# Altium project Logic Controller REV1.PrjPcb
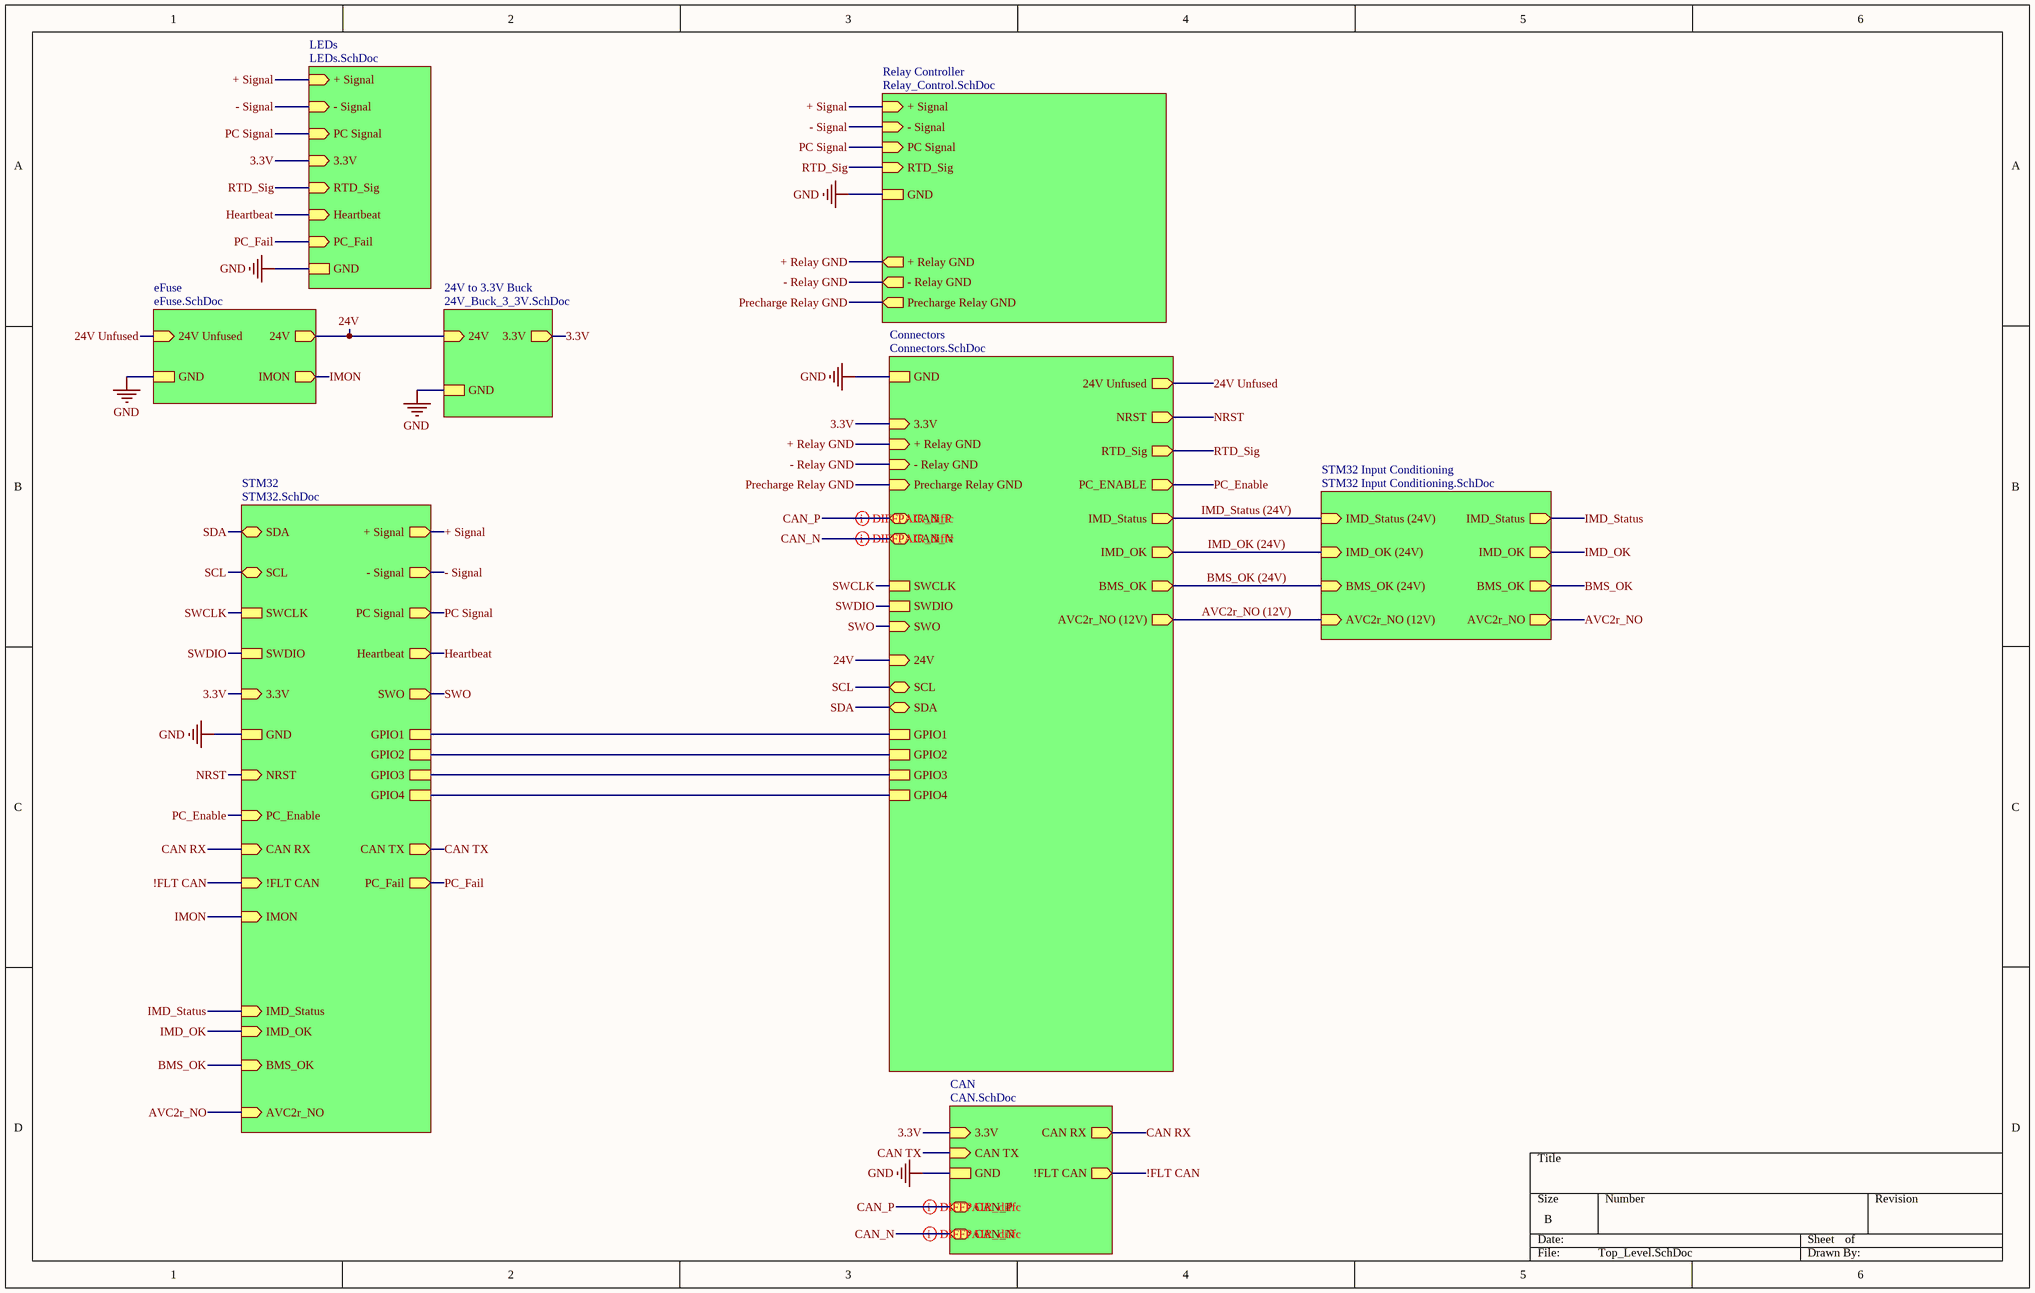
[diagram p0: Top_Level.SchDoc]
10 sheets, 106 parts. Net scope: hierarchical (ports join the sheet entries above them; power ports are global).
Board file: Logic_Controller_REV1.PcbDoc
Sheets:
  Top_Level.SchDoc
    Relay Controller = Relay_Control.SchDoc
    Connectors = Connectors.SchDoc
    LEDs = LEDs.SchDoc
      + = LED_Driver.SchDoc
      - = LED_Driver.SchDoc
      PC = LED_Driver.SchDoc
      HB = LED_Driver.SchDoc
      RTD_Sig_In = LED_Driver.SchDoc
      PC_Fail = Precharge_Fail.SchDoc
    STM32 = STM32.SchDoc
    eFuse = eFuse.SchDoc
    24V to 3.3V Buck = 24V_Buck_3_3V.SchDoc
    CAN = CAN.SchDoc

## Sheet Top_Level.SchDoc
size B; SheetNumber: 2; SheetTotal: 13

### Sub-sheets
24V to 3.3V Buck = 24V_Buck_3_3V.SchDoc: 24V (in), GND, 3.3V (out)
CAN = CAN.SchDoc: 3.3V (in), GND, CAN RX (out), CAN TX (in), !FLT CAN (out), CAN_P (bidir), CAN_N (bidir)
Connectors = Connectors.SchDoc: GND, + Relay GND (in), - Relay GND (in), Precharge Relay GND (in), 24V Unfused (out), 3.3V (in), NRST (out), GPIO1, GPIO2, GPIO3, GPIO4, PC_ENABLE (out), CAN_P (bidir), CAN_N (bidir), RTD_Sig (out), 24V (in), SWCLK, SWDIO, SWO (in), SCL (bidir), SDA (bidir), IMD_Status (out), IMD_OK (out), BMS_OK (out), AVC2r_NO (12V) (out)
eFuse = eFuse.SchDoc: 24V Unfused (in), GND, 24V (out), IMON (out)
LEDs = LEDs.SchDoc: + Signal (in), - Signal (in), PC Signal (in), 3.3V (in), GND, RTD_Sig (in), Heartbeat (in), PC_Fail (in)
Relay Controller = Relay_Control.SchDoc: + Signal (in), - Signal (in), PC Signal (in), RTD_Sig (in), GND, + Relay GND (out), - Relay GND (out), Precharge Relay GND (out)
STM32 = STM32.SchDoc: SDA (bidir), SCL (bidir), 3.3V (in), + Signal (out), - Signal (out), PC Signal (out), GND, SWCLK, SWDIO, SWO (out), NRST (in), GPIO1, GPIO2, GPIO3, GPIO4, PC_Enable (in), CAN TX (out), CAN RX (in), Heartbeat (out), !FLT CAN (in), IMON (in), PC_Fail (out), IMD_Status (in), IMD_OK (in), BMS_OK (in), AVC2r_NO (in)
STM32 Input Conditioning = STM32 Input Conditioning.SchDoc (file not in this document): IMD_Status (24V) (in), BMS_OK (24V) (in), IMD_Status (out), IMD_OK (24V) (in), IMD_OK (out), AVC2r_NO (12V) (in), BMS_OK (out), AVC2r_NO (out)

### Nets
GND: sheet Relay Controller/GND, sheet Connectors/GND, sheet LEDs/GND, sheet STM32/GND, sheet eFuse/GND, sheet 24V to 3.3V Buck/GND, sheet CAN/GND
3.3V: sheet Connectors/3.3V, sheet LEDs/3.3V, sheet STM32/3.3V, sheet 24V to 3.3V Buck/3.3V, sheet CAN/3.3V
24V: sheet Connectors/24V, sheet eFuse/24V, sheet 24V to 3.3V Buck/24V
24V Unfused: sheet Connectors/24V Unfused, sheet eFuse/24V Unfused
!FLT CAN: sheet STM32/!FLT CAN, sheet CAN/!FLT CAN
+ Relay GND: sheet Relay Controller/+ Relay GND, sheet Connectors/+ Relay GND
+ Signal: sheet Relay Controller/+ Signal, sheet LEDs/+ Signal, sheet STM32/+ Signal
- Relay GND: sheet Relay Controller/- Relay GND, sheet Connectors/- Relay GND
- Signal: sheet Relay Controller/- Signal, sheet LEDs/- Signal, sheet STM32/- Signal
AVC2r_NO: sheet STM32/AVC2r_NO, sheet STM32 Input Conditioning/AVC2r_NO
AVC2r_NO (12V): sheet Connectors/AVC2r_NO (12V), sheet STM32 Input Conditioning/AVC2r_NO (12V)
BMS_OK: sheet STM32/BMS_OK, sheet STM32 Input Conditioning/BMS_OK
BMS_OK (24V): sheet Connectors/BMS_OK, sheet STM32 Input Conditioning/BMS_OK (24V)
CAN RX: sheet STM32/CAN RX, sheet CAN/CAN RX
CAN TX: sheet STM32/CAN TX, sheet CAN/CAN TX
CAN_N: sheet Connectors/CAN_N, sheet CAN/CAN_N
CAN_P: sheet Connectors/CAN_P, sheet CAN/CAN_P
Heartbeat: sheet LEDs/Heartbeat, sheet STM32/Heartbeat
IMD_OK: sheet STM32/IMD_OK, sheet STM32 Input Conditioning/IMD_OK
IMD_OK (24V): sheet Connectors/IMD_OK, sheet STM32 Input Conditioning/IMD_OK (24V)
IMD_Status: sheet STM32/IMD_Status, sheet STM32 Input Conditioning/IMD_Status
IMD_Status (24V): sheet Connectors/IMD_Status, sheet STM32 Input Conditioning/IMD_Status (24V)
IMON: sheet STM32/IMON, sheet eFuse/IMON
NRST: sheet Connectors/NRST, sheet STM32/NRST
PC Signal: sheet Relay Controller/PC Signal, sheet LEDs/PC Signal, sheet STM32/PC Signal
PC_Enable: sheet Connectors/PC_ENABLE, sheet STM32/PC_Enable
PC_Fail: sheet LEDs/PC_Fail, sheet STM32/PC_Fail
Precharge Relay GND: sheet Relay Controller/Precharge Relay GND, sheet Connectors/Precharge Relay GND
RTD_Sig: sheet Relay Controller/RTD_Sig, sheet Connectors/RTD_Sig, sheet LEDs/RTD_Sig
SCL: sheet Connectors/SCL, sheet STM32/SCL
SDA: sheet Connectors/SDA, sheet STM32/SDA
SWCLK: sheet Connectors/SWCLK, sheet STM32/SWCLK
SWDIO: sheet Connectors/SWDIO, sheet STM32/SWDIO
SWO: sheet Connectors/SWO, sheet STM32/SWO
NetIC1_21: sheet Connectors/GPIO1, sheet STM32/GPIO1
NetIC1_23: sheet Connectors/GPIO2, sheet STM32/GPIO2
NetIC1_25: sheet Connectors/GPIO3, sheet STM32/GPIO3
NetIC1_27: sheet Connectors/GPIO4, sheet STM32/GPIO4

### Layout directives
differential pair; differential pair class diffc; differential pair: CAN_N, CAN_P

## Sheet Relay_Control.SchDoc
size A; SheetNumber: 9; SheetTotal: 13
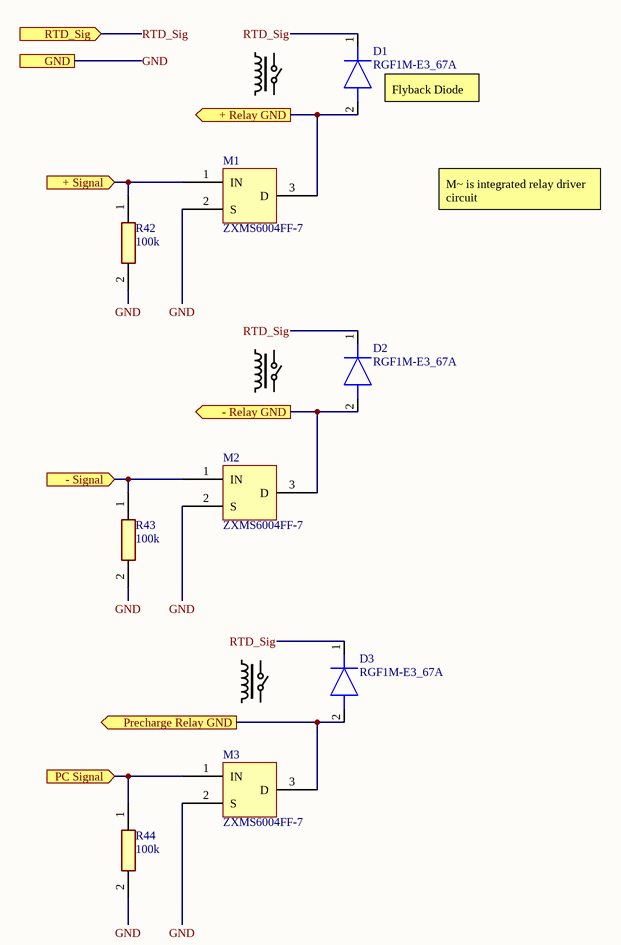
[diagram p1: Relay_Control.SchDoc]

### Parts
D1  RGF1M-E3_67A  [DIOM5426X300N]
D2  RGF1M-E3_67A  [DIOM5426X300N]
D3  RGF1M-E3_67A  [DIOM5426X300N]
M1  ZXMS6004FF-7  [SOT95P240X100-3N]
M2  ZXMS6004FF-7  [SOT95P240X100-3N]
M3  ZXMS6004FF-7  [SOT95P240X100-3N]
R42  100k  [RESC1608X55N]
R43  100k  [RESC1608X55N]
R44  100k  [RESC1608X55N]

### Ports
+ Relay GND (out), + Signal (in), - Relay GND (out), - Signal (in), GND, PC Signal (in), Precharge Relay GND (out), RTD_Sig (in)

### Nets
GND: M1.2(S) M2.2(S) M3.2(S) R42.2 R43.2 R44.2 ; port GND
+ Relay GND: D1.2(A) M1.3(D) ; port + Relay GND
+ Signal: M1.1(IN) R42.1 ; port + Signal
- Relay GND: D2.2(A) M2.3(D) ; port - Relay GND
- Signal: M2.1(IN) R43.1 ; port - Signal
PC Signal: M3.1(IN) R44.1 ; port PC Signal
Precharge Relay GND: D3.2(A) M3.3(D) ; port Precharge Relay GND
RTD_Sig: D1.1(K) D2.1(K) D3.1(K) ; port RTD_Sig

### Notes on the sheet
- (near D1) Flyback Diode
- M~ is integrated relay driver circuit

### Library data of the parts
D1-D3 = RGF1M-E3_67A: Diode; Manufacturer_Name: Vishay; Manufacturer_Part_Number: RGF1M-E3/67A; Datasheet Link: https://www.vishay.com/docs/88697/rgf1.pdf; Height: 3mm; Mouser Part Number: 625-RGF1M-E3; Mouser Price/Stock: https://www.mouser.co.uk/ProductDetail/Vishay-General-Semiconductor/RGF1M-E3-67A?qs=4xyK702%2F%252BQ1dl%252BTCdyIThg%3D%3D; Arrow Part Number: RGF1M-E3/67A; Arrow Price/Stock: https://www.arrow.com/en/products/rgf1m-e367a/vishay?region=nac
R42-R44 = CR0603-JW-104ELF: Resistor; Manufacturer_Name: Bourns; Datasheet Link: https://www.bourns.com/pdfs/chpreztr.pdf; Height: 0.55mm; Manufacturer_Part_Number: CR0603-JW-104ELF; Mouser Part Number: 652-CR0603-JW-104ELF; Mouser Price/Stock: https://www.mouser.co.uk/ProductDetail/Bourns/CR0603-JW-104ELF?qs=wOX%252BDVkMoZSK2gq9cFrtRg%3D%3D; Arrow Part Number: CR0603-JW-104ELF; Arrow Price/Stock: https://www.arrow.com/en/products/cr0603-jw-104elf/bourns?region=nac

## Sheet Connectors.SchDoc
size A; SheetNumber: 4; SheetTotal: 13
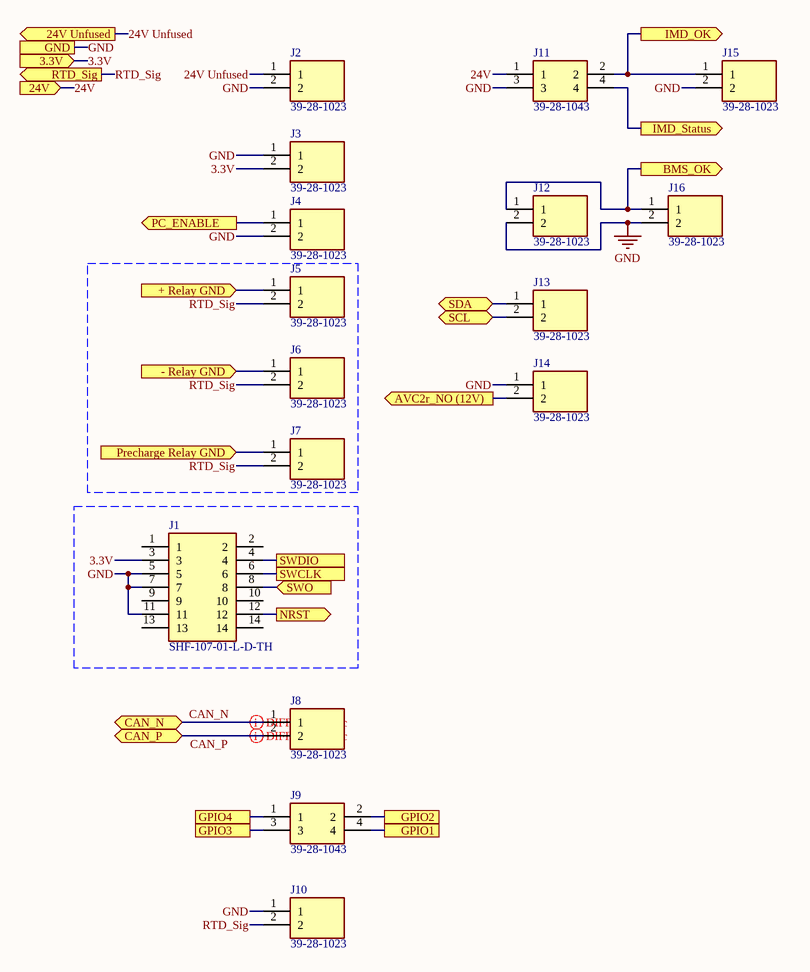
[diagram p2: Connectors.SchDoc]

### Parts
J1  SHF-107-01-L-D-TH  [SHF10701LDTH]
J2  39-28-1023  [39-28-1023]
J3  39-28-1023  [39-28-1023]
J4  39-28-1023  [39-28-1023]
J5  39-28-1023  [39-28-1023]
J6  39-28-1023  [39-28-1023]
J7  39-28-1023  [39-28-1023]
J8  39-28-1023  [39-28-1023]
J9  39-28-1043  [39-28-1043]
J10  39-28-1023  [39-28-1023]
J11  39-28-1043  [39-28-1043]
J12  39-28-1023  [39-28-1023]
J13  39-28-1023  [39-28-1023]
J14  39-28-1023  [39-28-1023]
J15  39-28-1023  [39-28-1023]
J16  39-28-1023  [39-28-1023]

### Ports
3.3V (in), 24V (in), 24V Unfused (out), + Relay GND (in), - Relay GND (in), AVC2r_NO (12V) (out), BMS_OK (out), CAN_N (bidir), CAN_P (bidir), GND, GPIO1, GPIO2, GPIO3, GPIO4, IMD_OK (out), IMD_Status (out), NRST (out), PC_ENABLE (out), Precharge Relay GND (in), RTD_Sig (out), SCL (bidir), SDA (bidir), SWCLK, SWDIO, SWO (in)

### Nets
GND: J1.5 J1.7 J1.11 J2.2 J3.1 J4.2 J10.1 J11.3 J12.2 J14.1 J15.2 J16.2 ; port GND
3.3V: J1.3 J3.2 ; port 3.3V
24V: J11.1 ; port 24V
24V Unfused: J2.1 ; port 24V Unfused
+ Relay GND: J5.1 ; port + Relay GND
- Relay GND: J6.1 ; port - Relay GND
AVC2r_NO (12V): J14.2 ; port AVC2r_NO (12V)
BMS_OK (24V): J12.1 J16.1 ; port BMS_OK
CAN_N: J8.1 ; port CAN_N
CAN_P: J8.2 ; port CAN_P
IMD_OK (24V): J11.2 J15.1 ; port IMD_OK
IMD_Status (24V): J11.4 ; port IMD_Status
NRST: J1.12 ; port NRST
PC_Enable: J4.1 ; port PC_ENABLE
Precharge Relay GND: J7.1 ; port Precharge Relay GND
RTD_Sig: J5.2 J6.2 J7.2 J10.2 ; port RTD_Sig
SCL: J13.2 ; port SCL
SDA: J13.1 ; port SDA
SWCLK: J1.6 ; port SWCLK
SWDIO: J1.4 ; port SWDIO
SWO: J1.8 ; port SWO
NetIC1_21: J9.4 ; port GPIO1
NetIC1_23: J9.2 ; port GPIO2
NetIC1_25: J9.3 ; port GPIO3
NetIC1_27: J9.1 ; port GPIO4

Not connected (* = marked no-connect by the designer): J1 1 2 9 10 13 14

### Layout directives
differential pair; differential pair class diffc: CAN_N, CAN_P

### Library data of the parts
J1 = SHF-107-01-L-D-TH: Connector; Manufacturer_Name: SAMTEC; Datasheet Link: https://componentsearchengine.com/Datasheets/1/SHF-107-01-L-D-TH.pdf; Height: 5.33mm; Manufacturer_Part_Number: SHF-107-01-L-D-TH; Mouser Part Number: 200-SHF10701LDTH; Mouser Price/Stock: https://www.mouser.co.uk/ProductDetail/Samtec/SHF-107-01-L-D-TH?qs=%252BZP6%2F%252BtExtDrbekpOnhfag%3D%3D; Arrow Part Number: SHF-107-01-L-D-TH; Arrow Price/Stock: https://www.arrow.com/en/products/shf-107-01-l-d-th/samtec?utm_currency=USD&region=nac
J2-J8 J10 J12-J16 = 39-28-1023: Connector; Manufacturer_Name: Molex; Datasheet Link: https://www.molex.com/pdm_docs/sd/039281023_sd.pdf; Height: 12.8mm; Manufacturer_Part_Number: 39-28-1023; Mouser Part Number: 538-39-28-1023; Mouser Price/Stock: https://www.mouser.co.uk/ProductDetail/Molex/39-28-1023?qs=LQQHZ4xw2XBykFU0jRHvlQ%3D%3D; Arrow Part Number: 39-28-1023; Arrow Price/Stock: https://www.arrow.com/en/products/39-28-1023/molex?region=nac
J9 J11 = 39-28-1043: Connector; Manufacturer_Name: Molex; Datasheet Link: https://www.molex.com/pdm_docs/sd/039281023_sd.pdf; Height: 12.8mm; Manufacturer_Part_Number: 39-28-1043; Mouser Part Number: 538-39-28-1043; Mouser Price/Stock: https://www.mouser.co.uk/ProductDetail/Molex/39-28-1043?qs=LQQHZ4xw2XCMHoV0KRLGhg%3D%3D; Arrow Part Number: 39-28-1043; Arrow Price/Stock: https://www.arrow.com/en/products/39-28-1043/molex?region=nac

## Sheet LEDs.SchDoc
size A; SheetNumber: 5; SheetTotal: 10
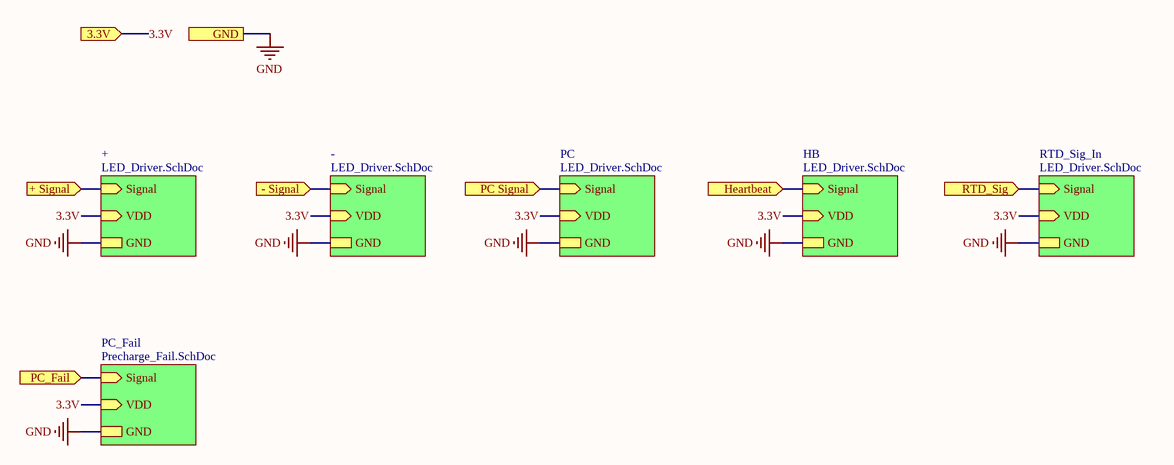
[diagram p3: LEDs.SchDoc]

### Sub-sheets
+ = LED_Driver.SchDoc: Signal (in), VDD (in), GND
- = LED_Driver.SchDoc: Signal (in), VDD (in), GND
HB = LED_Driver.SchDoc: Signal (in), VDD (in), GND
PC = LED_Driver.SchDoc: Signal (in), VDD (in), GND
PC_Fail = Precharge_Fail.SchDoc: Signal (in), VDD (in), GND
RTD_Sig_In = LED_Driver.SchDoc: Signal (in), VDD (in), GND

### Ports
3.3V (in), + Signal (in), - Signal (in), GND, Heartbeat (in), PC Signal (in), PC_Fail (in), RTD_Sig (in)

### Nets
GND: port GND, sheet +/GND, sheet -/GND, sheet PC/GND, sheet HB/GND, sheet RTD_Sig_In/GND, sheet PC_Fail/GND
3.3V: port 3.3V, sheet +/VDD, sheet -/VDD, sheet PC/VDD, sheet HB/VDD, sheet RTD_Sig_In/VDD, sheet PC_Fail/VDD
+ Signal: port + Signal, sheet +/Signal
- Signal: port - Signal, sheet -/Signal
Heartbeat: port Heartbeat, sheet HB/Signal
PC Signal: port PC Signal, sheet PC/Signal
PC_Fail: port PC_Fail, sheet PC_Fail/Signal
RTD_Sig: port RTD_Sig, sheet RTD_Sig_In/Signal

## Sheet LED_Driver.SchDoc
size A; SheetNumber: 6; SheetTotal: 10
Used 5 times, as channels LEDs/+, LEDs/-, LEDs/PC, LEDs/HB, LEDs/RTD_Sig_In. Parts and nets are listed once, with the designators drawn on the sheet.
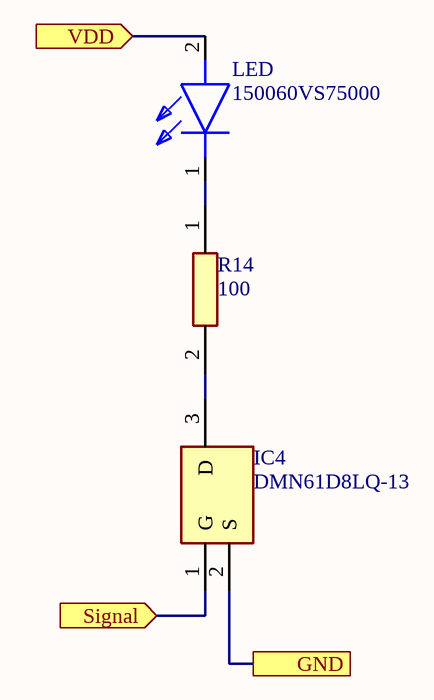
[diagram p4: LED_Driver.SchDoc]

### Parts
IC4  DMN61D8LQ-13  [SOT96P240X110-3N]
LED  150060VS75000  [LEDC1608X70N]
R14  100  [RESC1608X55N]

### Ports
GND, Signal (in), VDD (in)

### Nets
GND: IC4.2(S) ; port GND
Signal: IC4.1(G) ; port Signal
VDD: LED.2(A) ; port VDD
NetIC4_3: IC4.3(D) R14.2
NetLED_1: LED.1(K) R14.1

### Channels
LEDs/+: designators end in _+; ports GND=GND Signal=+ Signal VDD=3.3V
LEDs/-: designators end in _-; ports GND=GND Signal=- Signal VDD=3.3V
LEDs/PC: designators end in _PC; ports GND=GND Signal=PC Signal VDD=3.3V
LEDs/HB: designators end in _HB; ports GND=GND Signal=Heartbeat VDD=3.3V
LEDs/RTD_Sig_In: designators end in _RTD; ports GND=GND Signal=RTD_Sig VDD=3.3V

### Library data of the parts
IC4 = DMN61D8LQ-13: Integrated Circuit; Manufacturer_Name: Diodes Incorporated; Datasheet Link: https://www.diodes.com//assets/Datasheets/DMN61D8LQ.pdf; Height: 1.1mm; Manufacturer_Part_Number: DMN61D8LQ-13; Mouser Part Number: 621-DMN61D8LQ-13; Mouser Price/Stock: https://www.mouser.co.uk/ProductDetail/Diodes-Incorporated/DMN61D8LQ-13?qs=DBvH5xl4UymJgoulTjiNCg%3D%3D; Arrow Part Number: DMN61D8LQ-13; Arrow Price/Stock: https://www.arrow.com/en/products/dmn61d8lq-13/diodes-incorporated?utm_currency=USD&region=nac
LED = 150060VS75000: LED; Manufacturer_Name: Wurth Elektronik; Datasheet Link: https://www.we-online.com/catalog/datasheet/150060VS75000.pdf; Height: 0.7mm; Manufacturer_Part_Number: 150060VS75000; Mouser Part Number: 710-150060VS75000; Mouser Price/Stock: https://www.mouser.co.uk/ProductDetail/Wurth-Elektronik/150060VS75000?qs=LlUlMxKIyB1Q1Bi5mQ%2FKLw%3D%3D
R14 = RC0603JR-7W100RL: Resistor; Manufacturer_Name: Yageo Group; Datasheet Link: http://www.yageo.com/documents/recent/PYu-RC0603_51_RoHS_L_v5.pdf; Height: 0.55mm; Manufacturer_Part_Number: RC0603JR-7W100RL; Mouser Part Number: 603-RC0603JR-7W100RL; Mouser Price/Stock: https://www.mouser.co.uk/ProductDetail/YAGEO/RC0603JR-7W100RL?qs=tggtontpCXNb6PZs9ghEpg%3D%3D; Arrow Part Number: RC0603JR-7W100RL; Arrow Price/Stock: https://www.arrow.com/en/products/rc0603jr-7w100rl/yageo?region=nac

## Sheet Precharge_Fail.SchDoc
size A
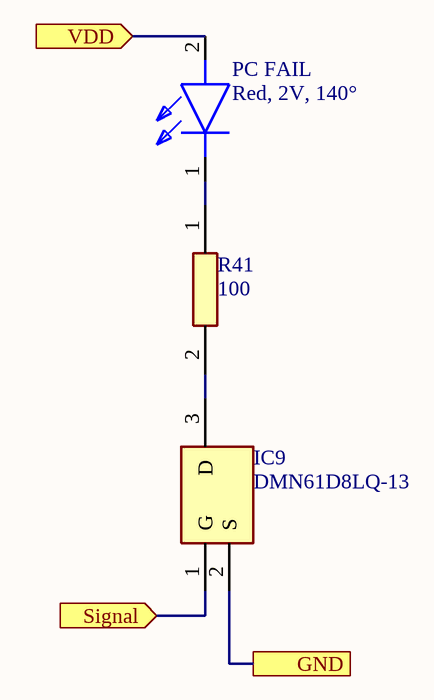
[diagram p5: Precharge_Fail.SchDoc]

### Parts
IC9  DMN61D8LQ-13  [SOT96P240X110-3N]
PC_FAIL  Red, 2V, 140°  [LEDC1608X70N]
R41  100  [RESC1608X55N]

### Ports
GND, Signal (in), VDD (in)

### Nets
GND: IC9.2(S) ; port GND
3.3V: PC_FAIL.2(A) ; port VDD
PC_Fail: IC9.1(G) ; port Signal
NetIC9_3: IC9.3(D) R41.2
NetPC_FAIL_1: PC_FAIL.1(K) R41.1

### Library data of the parts
IC9 = DMN61D8LQ-13: as IC4 on sheet LED_Driver; Datasheet Link: https://www.diodes.com//assets/Datasheets/DMN61D8LQ.pdf; Height: 1.1mm; Manufacturer_Part_Number: DMN61D8LQ-13; Mouser Part Number: 621-DMN61D8LQ-13; Mouser Price/Stock: https://www.mouser.co.uk/ProductDetail/Diodes-Incorporated/DMN61D8LQ-13?qs=DBvH5xl4UymJgoulTjiNCg%3D%3D; Arrow Part Number: DMN61D8LQ-13; Arrow Price/Stock: https://www.arrow.com/en/products/dmn61d8lq-13/diodes-incorporated?utm_currency=USD&region=nac
PC_FAIL = 150060RS75000: LED; Manufacturer_Name: Wurth Elektronik; Datasheet Link: https://www.we-online.com/catalog/datasheet/150060RS75000.pdf; Height: 0.7mm; Manufacturer_Part_Number: 150060RS75000; Mouser Part Number: 710-150060RS75000; Mouser Price/Stock: https://www.mouser.co.uk/ProductDetail/Wurth-Elektronik/150060RS75000?qs=LlUlMxKIyB3QnmZ3fw%2FVCA%3D%3D
R41 = RC0603JR-7W100RL: Resistor; Manufacturer_Name: Yageo Group; Datasheet Link: http://www.yageo.com/documents/recent/PYu-RC0603_51_RoHS_L_v5.pdf; Height: 0.55mm; Manufacturer_Part_Number: RC0603JR-7W100RL; Mouser Part Number: 603-RC0603JR-7W100RL; Mouser Price/Stock: https://www.mouser.co.uk/ProductDetail/YAGEO/RC0603JR-7W100RL?qs=tggtontpCXNb6PZs9ghEpg%3D%3D; Arrow Part Number: RC0603JR-7W100RL; Arrow Price/Stock: https://www.arrow.com/en/products/rc0603jr-7w100rl/yageo?region=nac

## Sheet STM32.SchDoc
size A; SheetNumber: 1; SheetTotal: 13
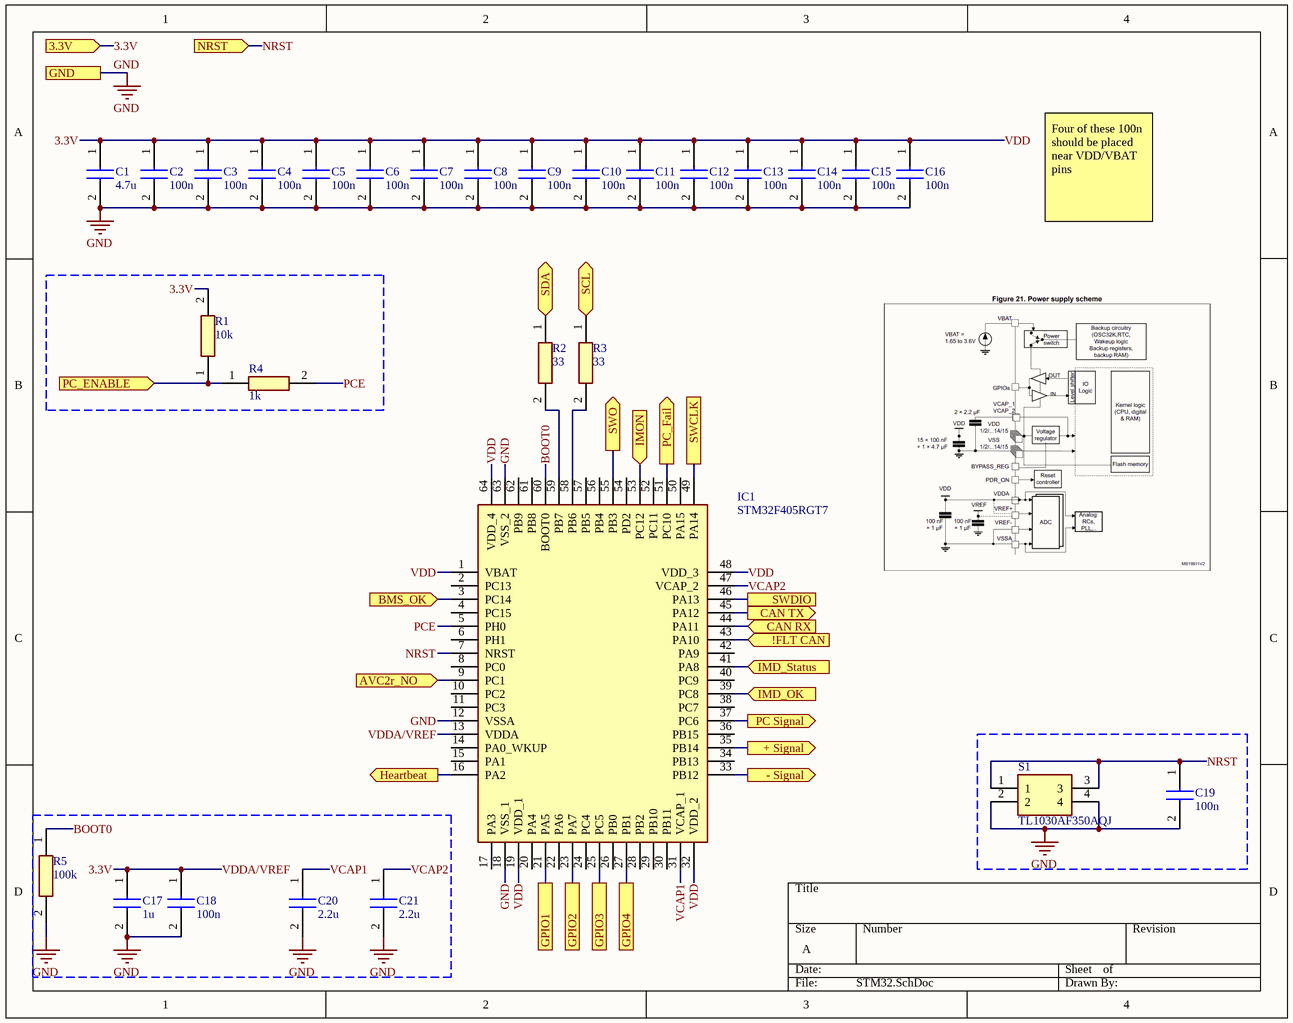
[diagram p6: STM32.SchDoc]

### Parts
C1  4.7u  [CAPC2012X145N]
C2  100n  [CAPC1608X90N]
C3  100n  [CAPC1608X90N]
C4  100n  [CAPC1608X90N]
C5  100n  [CAPC1608X90N]
C6  100n  [CAPC1608X90N]
C7  100n  [CAPC1608X90N]
C8  100n  [CAPC1608X90N]
C9  100n  [CAPC1608X90N]
C10  100n  [CAPC1608X90N]
C11  100n  [CAPC1608X90N]
C12  100n  [CAPC1608X90N]
C13  100n  [CAPC1608X90N]
C14  100n  [CAPC1608X90N]
C15  100n  [CAPC1608X90N]
C16  100n  [CAPC1608X90N]
C17  1u  [CAPC1608X95N]
C18  100n  [CAPC1608X90N]
C19  100n  [CAPC1608X90N]
C20  2.2u  [MBASx168]
C21  2.2u  [MBASx168]
IC1  STM32F405RGT7  [QFP50P1200X1200X160-64N]
R1  10k  [RESC1608X55N]
R2  33  [RESC1608X50N]
R3  33  [RESC1608X50N]
R4  1k  [RESC1608X55N]
R5  100k  [RESC1608X55N]
S1  TL1030AF350AQJ  [TL1030AF350AQJ]

### Ports
3.3V (in), !FLT CAN (in), + Signal (out), - Signal (out), AVC2r_NO (in), BMS_OK (in), CAN RX (in), CAN TX (out), GND, GPIO1, GPIO2, GPIO3, GPIO4, Heartbeat (out), IMD_OK (in), IMD_Status (in), IMON (in), NRST (in), PC Signal (out), PC_ENABLE (in), PC_Fail (out), SCL (bidir), SDA (bidir), SWCLK, SWDIO, SWO (out)

### Nets
GND: C1.2 C2.2 C3.2 C4.2 C5.2 C6.2 C7.2 C8.2 C9.2 C10.2 C11.2 C12.2 C13.2 C14.2 C15.2 C16.2 C17.2 C18.2 C19.2 C20.2 C21.2 IC1.12(VSSA) IC1.18(VSS_1) IC1.63(VSS_2) R5.2 S1.2 S1.4 ; port GND
3.3V: C1.1 C2.1 C3.1 C4.1 C5.1 C6.1 C7.1 C8.1 C9.1 C10.1 C11.1 C12.1 C13.1 C14.1 C15.1 C16.1 C17.1 C18.1 IC1.1(VBAT) IC1.13(VDDA) IC1.19(VDD_1) IC1.32(VDD_2) IC1.48(VDD_3) IC1.64(VDD_4) R1.2 ; port 3.3V  [also labelled VDD, VDDA/VREF]
!FLT CAN: IC1.43(PA10) ; port !FLT CAN
+ Signal: IC1.35(PB14) ; port + Signal
- Signal: IC1.33(PB12) ; port - Signal
AVC2r_NO: IC1.9(PC1) ; port AVC2r_NO
BMS_OK: IC1.3(PC14) ; port BMS_OK
BOOT0: IC1.60(BOOT0) R5.1
CAN RX: IC1.44(PA11) ; port CAN RX
CAN TX: IC1.45(PA12) ; port CAN TX
Heartbeat: IC1.16(PA2) ; port Heartbeat
IMD_OK: IC1.39(PC8) ; port IMD_OK
IMD_Status: IC1.41(PA8) ; port IMD_Status
IMON: IC1.53(PC12) ; port IMON
NRST: C19.1 IC1.7(NRST) S1.1 S1.3 ; port NRST
PC Signal: IC1.37(PC6) ; port PC Signal
PC_Enable: R1.1 R4.1 ; port PC_ENABLE
PC_Fail: IC1.51(PC10) ; port PC_Fail
PCE: IC1.5(PH0) R4.2
SCL: R3.1 ; port SCL
SDA: R2.1 ; port SDA
SWCLK: IC1.49(PA14) ; port SWCLK
SWDIO: IC1.46(PA13) ; port SWDIO
SWO: IC1.55(PB3) ; port SWO
VCAP1: C20.1 IC1.31(VCAP_1)
VCAP2: C21.1 IC1.47(VCAP_2)
NetIC1_21: IC1.21(PA5) ; port GPIO1
NetIC1_23: IC1.23(PA7) ; port GPIO2
NetIC1_25: IC1.25(PC5) ; port GPIO3
NetIC1_27: IC1.27(PB1) ; port GPIO4
NetIC1_58: IC1.58(PB6) R3.2
NetIC1_59: IC1.59(PB7) R2.2

Not connected (* = marked no-connect by the designer): IC1 2(PC13) 4(PC15) 6(PH1) 8(PC0) 10(PC2) 11(PC3) 14(PA0_WKUP) 15(PA1) 17(PA3) 20(PA4) 22(PA6) 24(PC4) 26(PB0) 28(PB2) 29(PB10) 30(PB11) 34(PB13) 36(PB15) 38(PC7) 40(PC9) 42(PA9) 50(PA15) 52(PC11) 54(PD2) 56(PB4) 57(PB5) 61(PB8) 62(PB9)

### Notes on the sheet
- Four of these 100n should be placed near VDD/VBAT pins

### Library data of the parts
C1 = GRM21BR61H475ME51L: Capacitor; Manufacturer_Name: Murata Electronics; Datasheet Link: https://search.murata.co.jp/Ceramy/image/img/A01X/G101/ENG/GRM21BR61H475ME51-01A.pdf; Height: 1.45mm; Manufacturer_Part_Number: GRM21BR61H475ME51L; Mouser Part Number: 81-GRM21BR61H475M51L; Mouser Price/Stock: https://www.mouser.co.uk/ProductDetail/Murata-Electronics/GRM21BR61H475ME51L?qs=eeBpzGFlv%252B%2Fg0wAeHy0eJw%3D%3D; Arrow Part Number: GRM21BR61H475ME51L; Arrow Price/Stock: https://www.arrow.com/en/products/grm21br61h475me51l/murata-manufacturing?region=nac
C2-C16 C18 C19 = 06035C104J4Z2A: Capacitor; Manufacturer_Name: Kyocera AVX; Datasheet Link: https://componentsearchengine.com/Datasheets/1/06031A100FAT2A.pdf; Height: 0.9mm; Manufacturer_Part_Number: 06035C104J4Z2A; Mouser Part Number: 581-06035C104J4Z2A; Mouser Price/Stock: https://www.mouser.co.uk/ProductDetail/KYOCERA-AVX/06035C104J4Z2A?qs=Awwwc1gvTnlncvTGCFZvkw%3D%3D; Arrow Part Number: 06035C104J4Z2A; Arrow Price/Stock: https://www.arrow.com/en/products/06035c104j4z2a/avx
C17 = UMK107AB7105KA-T: Capacitor; Manufacturer_Name: TAIYO YUDEN; Datasheet Link: https://ds.yuden.co.jp/TYCOMPAS/or/detail?pn=UMK107AB7105KA-T&u=M; Height: 0.95mm; Manufacturer_Part_Number: UMK107AB7105KA-T; Mouser Part Number: 963-UMK107AB7105KA-T; Mouser Price/Stock: https://www.mouser.co.uk/ProductDetail/TAIYO-YUDEN/UMK107AB7105KA-T?qs=%252BAZVS4b%2FkgKLk%2FvFAZMoRQ%3D%3D; Arrow Part Number: UMK107AB7105KA-T; Arrow Price/Stock: https://www.arrow.com/en/products/umk107ab7105ka-t/taiyo-yuden?utm_currency=USD&region=nac
C20 C21 = MBASL168SB5225KTNA01: Capacitor; Manufacturer_Name: TAIYO YUDEN; Datasheet Link: https://ds.yuden.co.jp/TYCOMPAS/or/detail?pn=MBASL168SB5225KTNA01; Height: 0.8mm; Manufacturer_Part_Number: MBASL168SB5225KTNA01
IC1 = STM32F405RGT7: Integrated Circuit; Manufacturer_Name: STMicroelectronics; Datasheet Link: https://www.st.com/content/ccc/resource/technical/document/datasheet/ef/92/76/6d/bb/c2/4f/f7/DM00037051.pdf/files/DM00037051.pdf/jcr:content/translations/en.DM00037051.pdf; Height: 1.6mm; Manufacturer_Part_Number: STM32F405RGT7; Mouser Part Number: 511-STM32F405RGT7; Mouser Price/Stock: https://www.mouser.co.uk/ProductDetail/STMicroelectronics/STM32F405RGT7?qs=DqCdCwOw4%2F6rAq3yUvY8rA%3D%3D; Arrow Part Number: STM32F405RGT7; Arrow Price/Stock: https://www.arrow.com/en/products/stm32f405rgt7/stmicroelectronics?utm_currency=USD&region=nac
R1 = CRGCQ0603F10K: Resistor; Manufacturer_Name: TE Connectivity; Datasheet Link: https://www.te.com/commerce/DocumentDelivery/DDEController?Action=showdoc&DocId=Data+Sheet%7F1773204-3%7F1%7Fpdf%7FEnglish%7FENG_DS_1773204-3_1.pdf%7F5-2176339-2; Height: 0.55mm; Manufacturer_Part_Number: CRGCQ0603F10K; Mouser Part Number: 279-CRGCQ0603F10K; Mouser Price/Stock: https://www.mouser.co.uk/ProductDetail/TE-Connectivity-Holsworthy/CRGCQ0603F10K?qs=wUXugUrL1qxhM765MzQWJg%3D%3D; Arrow Part Number: CRGCQ0603F10K; Arrow Price/Stock: https://www.arrow.com/en/products/crgcq0603f10k/te-connectivity?region=nac
R2 R3 = CRCW060333R0JNEC: Resistor; Manufacturer_Name: Vishay; Datasheet Link: http://www.vishay.com/docs/20035/dcrcwe3.pdf; Height: 0.5mm; Manufacturer_Part_Number: CRCW060333R0JNEC; Mouser Part Number: 71-CRCW060333R0JNEC; Mouser Price/Stock: https://www.mouser.co.uk/ProductDetail/Vishay-Dale/CRCW060333R0JNEC?qs=ZO1m%252BzWAUg2kwAG1IfiiMA%3D%3D; Arrow Part Number: CRCW060333R0JNEC; Arrow Price/Stock: https://www.arrow.com/en/products/crcw060333r0jnec/vishay?region=nac
R4 = RMCF0603JT1K00: Resistor; Manufacturer_Name: Stackpole Electronics; Datasheet Link: https://www.seielect.com/Catalog/SEI-RMCF_RMCP.pdf; Height: 0.55mm; Manufacturer_Part_Number: RMCF0603JT1K00; Mouser Part Number: 708-RMCF0603JT1K00; Mouser Price/Stock: https://www.mouser.co.uk/ProductDetail/SEI-Stackpole/RMCF0603JT1K00?qs=FESYatJ8odK3lrUeqnFxyg%3D%3D; Arrow Part Number: RMCF0603JT1K00; Arrow Price/Stock: https://www.arrow.com/en/products/rmcf0603jt1k00/stackpole-electronics?region=nac
R5 = CR0603-JW-104ELF: Resistor; Manufacturer_Name: Bourns; Datasheet Link: https://www.bourns.com/pdfs/chpreztr.pdf; Height: 0.55mm; Manufacturer_Part_Number: CR0603-JW-104ELF; Mouser Part Number: 652-CR0603-JW-104ELF; Mouser Price/Stock: https://www.mouser.co.uk/ProductDetail/Bourns/CR0603-JW-104ELF?qs=wOX%252BDVkMoZSK2gq9cFrtRg%3D%3D; Arrow Part Number: CR0603-JW-104ELF; Arrow Price/Stock: https://www.arrow.com/en/products/cr0603-jw-104elf/bourns?region=nac
S1 = TL1030AF350AQJ: Switch; Manufacturer_Name: E-Switch; Datasheet Link: https://configured-product-images.s3.amazonaws.com/2D/specs/TL1030AF350AQJ.pdf; Height: 1.95mm; Manufacturer_Part_Number: TL1030AF350AQJ; Mouser Part Number: 612-TL1030AF350AQJ; Mouser Price/Stock: https://www.mouser.co.uk/ProductDetail/E-Switch/TL1030AF350AQJ?qs=VVKQmw408U%2FgalG8VZqjEg%3D%3D

## Sheet eFuse.SchDoc
size A; SheetNumber: 7; SheetTotal: 10
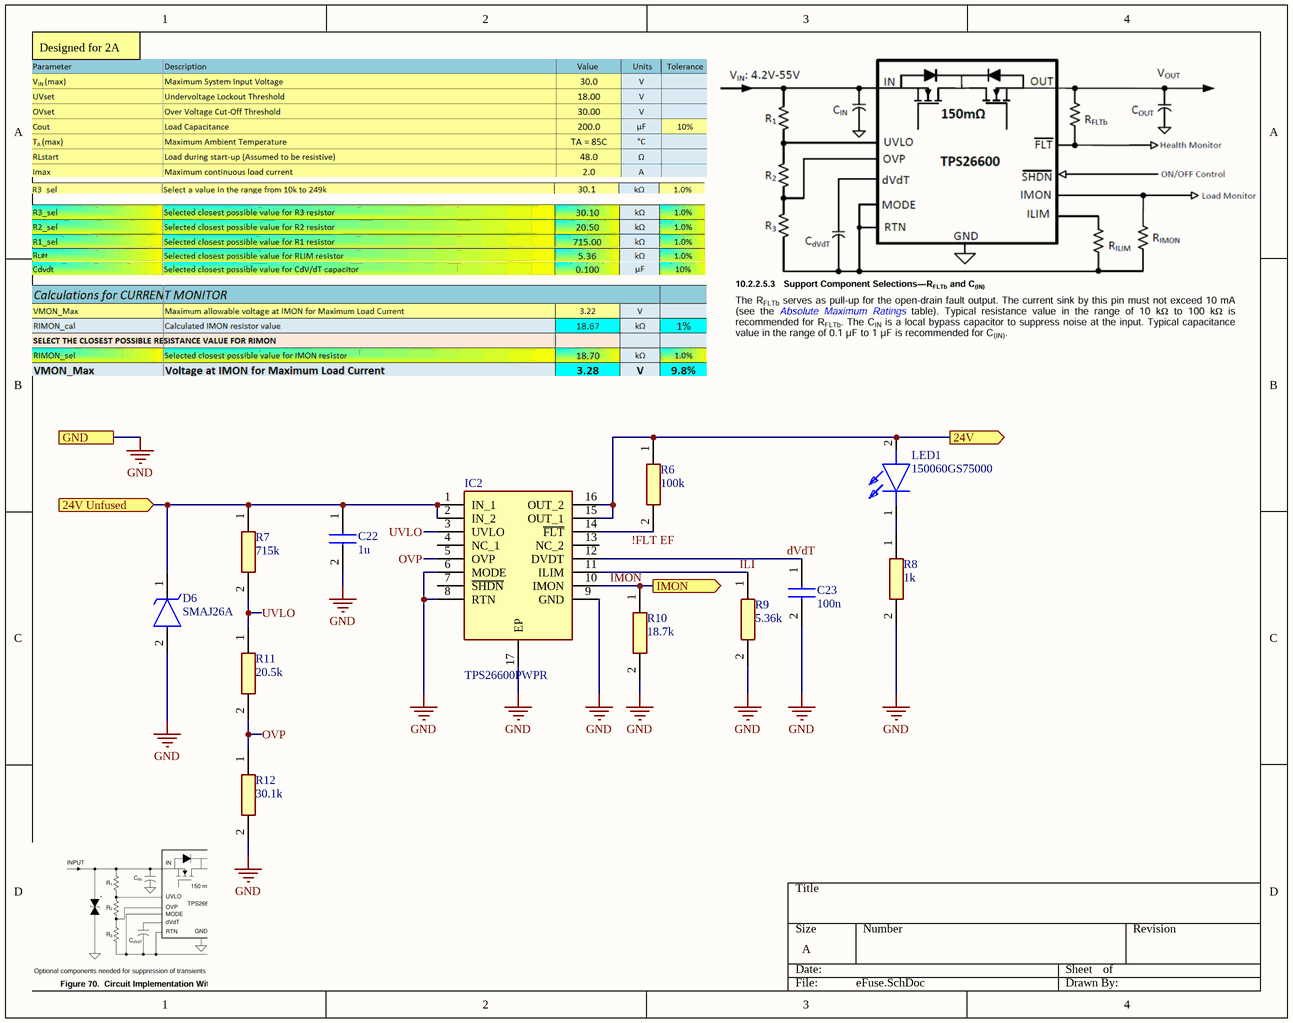
[diagram p7: eFuse.SchDoc]

### Parts
C22  1u  [CAPC1608X95N]
C23  100n  [CAPC1608X90N]
D6  SMAJ26A  [DIOM5026X229N]
IC2  TPS26600PWPR  [SOP65P640X120-17N]
LED1  150060GS75000  [LEDC1608X70N]
R6  100k  [RESC1608X55N]
R7  715k  [RESC1608X55N]
R8  1k  [RESC1608X55N]
R9  5.36k  [RESC1608X55N]
R10  18.7k  [RESC1608X55N]
R11  20.5k  [RESC1608X55N]
R12  30.1k  [ERJH3]

### Ports
24V (out), 24V Unfused (in), GND, IMON (out)

### Nets
GND: C22.2 C23.2 D6.2(A) IC2.6(MODE) IC2.8(RTN) IC2.9(GND) IC2.17(EP) R8.2 R9.2 R10.2 R12.2 ; port GND
24V: IC2.15(OUT_1) IC2.16(OUT_2) LED1.2(A) R6.1 ; port 24V
24V Unfused: C22.1 D6.1(K) IC2.1(IN_1) IC2.2(IN_2) R7.1 ; port 24V Unfused
!FLT EF: IC2.14(~{FLT}) R6.2
dVdT: C23.1 IC2.12(DVDT)
ILI: IC2.11(ILIM) R9.1
IMON: IC2.10(IMON) R10.1 ; port IMON
OVP: IC2.5(OVP) R11.2 R12.1
UVLO: IC2.3(UVLO) R7.2 R11.1
NetLED1_1: LED1.1(K) R8.1

Not connected (* = marked no-connect by the designer): IC2 4(NC_1) 7(~{SHDN}) 13(NC_2)

### Notes on the sheet
- Designed for 2A

### Library data of the parts
C22 = UMK107AB7105KA-T: as C17 on sheet STM32; Datasheet Link: https://ds.yuden.co.jp/TYCOMPAS/or/detail?pn=UMK107AB7105KA-T&u=M; Height: 0.95mm; Manufacturer_Part_Number: UMK107AB7105KA-T; Mouser Part Number: 963-UMK107AB7105KA-T; Mouser Price/Stock: https://www.mouser.co.uk/ProductDetail/TAIYO-YUDEN/UMK107AB7105KA-T?qs=%252BAZVS4b%2FkgKLk%2FvFAZMoRQ%3D%3D; Arrow Part Number: UMK107AB7105KA-T; Arrow Price/Stock: https://www.arrow.com/en/products/umk107ab7105ka-t/taiyo-yuden?utm_currency=USD&region=nac
C23 = 06035C104J4Z2A: as C2 on sheet STM32; Datasheet Link: https://componentsearchengine.com/Datasheets/1/06031A100FAT2A.pdf; Height: 0.9mm; Manufacturer_Part_Number: 06035C104J4Z2A; Mouser Part Number: 581-06035C104J4Z2A; Mouser Price/Stock: https://www.mouser.co.uk/ProductDetail/KYOCERA-AVX/06035C104J4Z2A?qs=Awwwc1gvTnlncvTGCFZvkw%3D%3D; Arrow Part Number: 06035C104J4Z2A; Arrow Price/Stock: https://www.arrow.com/en/products/06035c104j4z2a/avx
D6 = SMAJ26A: TVS Diode (Uni-directional); Manufacturer_Name: LITTELFUSE; Datasheet Link: https://www.littelfuse.com/~/media/electronics/datasheets/tvs_diodes/littelfuse_tvs_diode_smaj_datasheet.pdf.pdf; Height: 2.29mm; Manufacturer_Part_Number: SMAJ26A; Mouser Part Number: 576-SMAJ26A; Mouser Price/Stock: https://www.mouser.co.uk/ProductDetail/Littelfuse/SMAJ26A?qs=HR2RnyOI4E5UFOxZR4oQ3w%3D%3D; Arrow Part Number: SMAJ26A; Arrow Price/Stock: https://www.arrow.com/en/products/smaj26a/littelfuse?region=nac
IC2 = TPS26600PWPR: Integrated Circuit; Manufacturer_Name: Texas Instruments; Datasheet Link: http://www.ti.com/lit/gpn/tps2660; Height: 1.2mm; Manufacturer_Part_Number: TPS26600PWPR; Mouser Part Number: 595-TPS26600PWPR; Mouser Price/Stock: https://www.mouser.co.uk/ProductDetail/Texas-Instruments/TPS26600PWPR?qs=Bho%2FbeBaDExFVQBFO8fB%2FQ%3D%3D; Arrow Part Number: TPS26600PWPR; Arrow Price/Stock: https://www.arrow.com/en/products/tps26600pwpr/texas-instruments?region=nac
LED1 = 150060GS75000: LED; Manufacturer_Name: Wurth Elektronik; Datasheet Link: https://www.we-online.com/catalog/datasheet/150060GS75000.pdf; Height: 0.7mm; Manufacturer_Part_Number: 150060GS75000; Mouser Part Number: 710-150060GS75000; Mouser Price/Stock: https://www.mouser.co.uk/ProductDetail/Wurth-Elektronik/150060GS75000?qs=LlUlMxKIyB0UYkq5lDO8nA%3D%3D
R6 = CR0603-JW-104ELF: Resistor; Manufacturer_Name: Bourns; Datasheet Link: https://www.bourns.com/pdfs/chpreztr.pdf; Height: 0.55mm; Manufacturer_Part_Number: CR0603-JW-104ELF; Mouser Part Number: 652-CR0603-JW-104ELF; Mouser Price/Stock: https://www.mouser.co.uk/ProductDetail/Bourns/CR0603-JW-104ELF?qs=wOX%252BDVkMoZSK2gq9cFrtRg%3D%3D; Arrow Part Number: CR0603-JW-104ELF; Arrow Price/Stock: https://www.arrow.com/en/products/cr0603-jw-104elf/bourns?region=nac
R7 = ERJ-3RED7153V: Resistor; Manufacturer_Name: Panasonic; Height: 0.55mm; Manufacturer_Part_Number: ERJ-3RED7153V; Mouser Part Number: 667-ERJ-3RED7153V; Mouser Price/Stock: https://www.mouser.co.uk/ProductDetail/Panasonic/ERJ-3RED7153V?qs=KTDjhDDUMAkeRZjDK2%2FIGQ%3D%3D
R8 = RMCF0603JT1K00: as R4 on sheet STM32; Datasheet Link: https://www.seielect.com/Catalog/SEI-RMCF_RMCP.pdf; Height: 0.55mm; Manufacturer_Part_Number: RMCF0603JT1K00; Mouser Part Number: 708-RMCF0603JT1K00; Mouser Price/Stock: https://www.mouser.co.uk/ProductDetail/SEI-Stackpole/RMCF0603JT1K00?qs=FESYatJ8odK3lrUeqnFxyg%3D%3D; Arrow Part Number: RMCF0603JT1K00; Arrow Price/Stock: https://www.arrow.com/en/products/rmcf0603jt1k00/stackpole-electronics?region=nac
R9 = RK73H1JTTD5361F: Resistor; Manufacturer_Name: KOA Speer; Datasheet Link: http://www.koaspeer.com/catimages/Products/RK73-RT/RK73-RT.pdf; Height: 0.55mm; Manufacturer_Part_Number: RK73H1JTTD5361F; Mouser Part Number: 660-RK73H1JTTD5361F; Mouser Price/Stock: http://www.mouser.com/Search/ProductDetail.aspx?qs=VsVuNjgfZhozLTQBmeIWog%3d%3d
R10 = RMCF0603FT18K7: Resistor; Manufacturer_Name: Stackpole Electronics; Datasheet Link: https://www.seielect.com/Catalog/SEI-RMCF_RMCP.pdf; Height: 0.55mm; Manufacturer_Part_Number: RMCF0603FT18K7
R11 = ERJ-3EKF2052V: Resistor; Manufacturer_Name: Panasonic; Datasheet Link: http://industrial.panasonic.com/cdbs/www-data/pdf/RDA0000/AOA0000C86.pdf; Height: 0.55mm; Manufacturer_Part_Number: ERJ-3EKF2052V; Arrow Part Number: ERJ-3EKF2052V; Arrow Price/Stock: https://www.arrow.com/en/products/erj3ekf2052v/panasonic?region=nac
R12 = ERJ-H3EF3012V: Resistor; Manufacturer_Name: Panasonic; Datasheet Link: http://industrial.panasonic.com/cdbs/www-data/pdf/RDQ0000/ast-ind-151033.pdf; Manufacturer_Part_Number: ERJ-H3EF3012V

## Sheet 24V_Buck_3_3V.SchDoc
size A; SheetNumber: 13; SheetTotal: 13
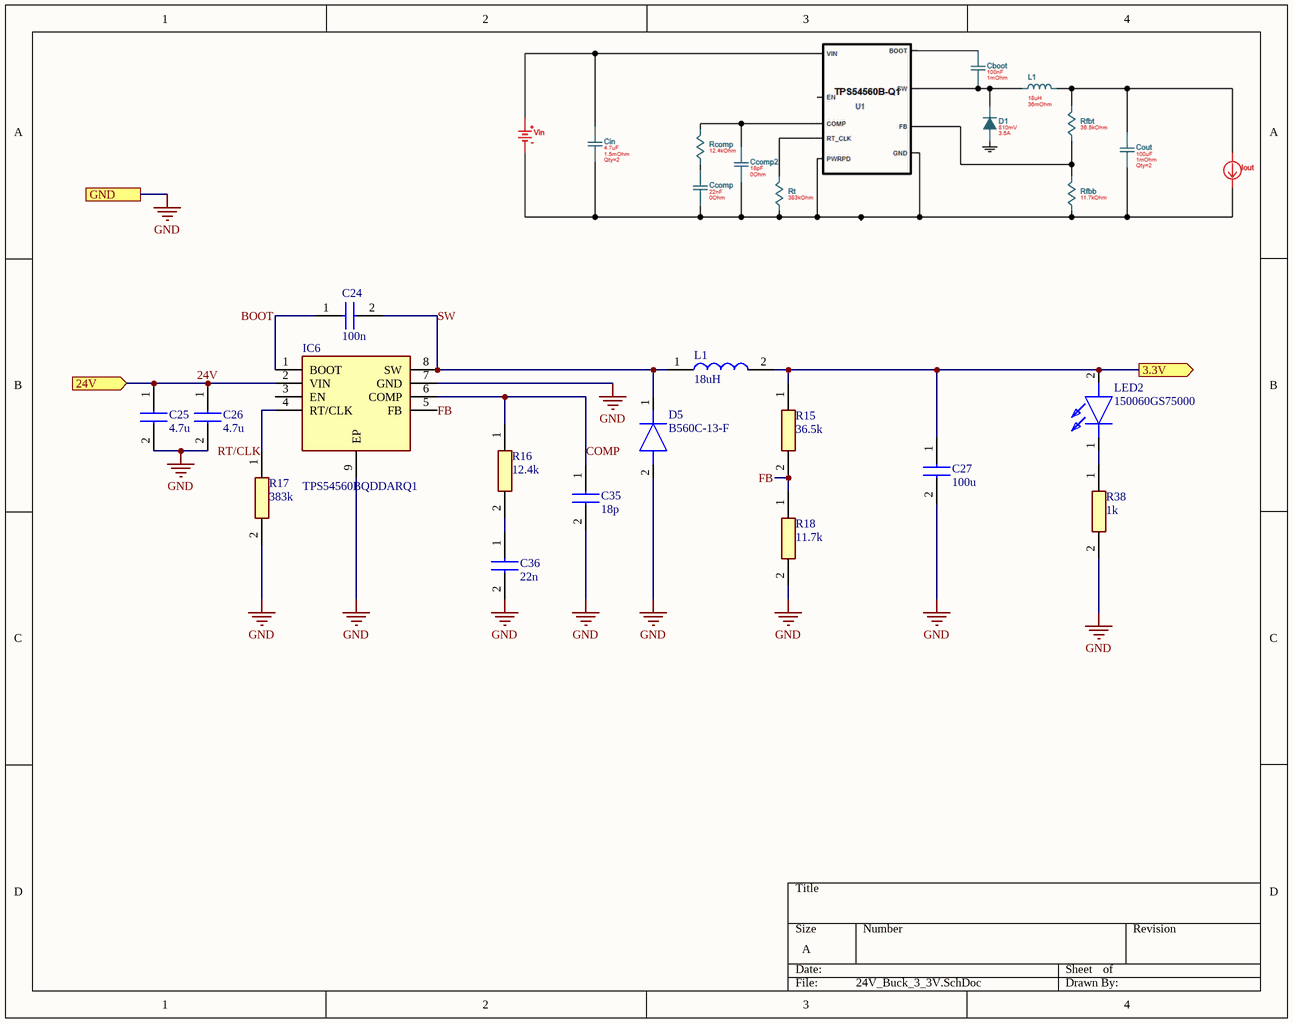
[diagram p8: 24V_Buck_3_3V.SchDoc]

### Parts
C24  100n  [CAPC1608X90N]
C25  4.7u  [CAPC2012X145N]
C26  4.7u  [CAPC2012X145N]
C27  100u  [CAPC3216X190N]
C35  18p  [CAPC1608X90N]
C36  22n  [CAPC1608X87N]
D5  B560C-13-F  [DIOM7959X250N]
IC6  TPS54560BQDDARQ1  [SOIC127P600X170-9N]
L1  18uH  [INDPM125125X800N]
LED2  150060GS75000  [LEDC1608X70N]
R15  36.5k  [RESC1608X55N]
R16  12.4k  [RESC1608X50N]
R17  383k  [RESC1608X55N]
R18  11.7k  [CAPC1608X55N]
R38  1k  [RESC1608X55N]

### Ports
3.3V (out), 24V (in), GND

### Nets
GND: C25.2 C26.2 C27.2 C35.2 C36.2 D5.2(A) IC6.7(GND) IC6.9(EP) R17.2 R18.2 R38.2 ; port GND
3.3V: C27.1 L1.2 LED2.2(A) R15.1 ; port 3.3V
24V: C25.1 C26.1 IC6.2(VIN) ; port 24V
BOOT: C24.1 IC6.1(BOOT)
COMP: C35.1 IC6.6(COMP) R16.1
FB: IC6.5(FB) R15.2 R18.1
RT/CLK: IC6.4(RT/CLK) R17.1
SW: C24.2 D5.1(K) IC6.8(SW) L1.1
NetC36_1: C36.1 R16.2
NetLED2_1: LED2.1(K) R38.1

Not connected (* = marked no-connect by the designer): IC6 3(EN)

### Library data of the parts
C24 = 06035C104J4Z2A: as C2 on sheet STM32; Datasheet Link: https://componentsearchengine.com/Datasheets/1/06031A100FAT2A.pdf; Height: 0.9mm; Manufacturer_Part_Number: 06035C104J4Z2A; Mouser Part Number: 581-06035C104J4Z2A; Mouser Price/Stock: https://www.mouser.co.uk/ProductDetail/KYOCERA-AVX/06035C104J4Z2A?qs=Awwwc1gvTnlncvTGCFZvkw%3D%3D; Arrow Part Number: 06035C104J4Z2A; Arrow Price/Stock: https://www.arrow.com/en/products/06035c104j4z2a/avx
C25 C26 = GRM21BR61H475ME51L: as C1 on sheet STM32; Datasheet Link: https://search.murata.co.jp/Ceramy/image/img/A01X/G101/ENG/GRM21BR61H475ME51-01A.pdf; Height: 1.45mm; Manufacturer_Part_Number: GRM21BR61H475ME51L; Mouser Part Number: 81-GRM21BR61H475M51L; Mouser Price/Stock: https://www.mouser.co.uk/ProductDetail/Murata-Electronics/GRM21BR61H475ME51L?qs=eeBpzGFlv%252B%2Fg0wAeHy0eJw%3D%3D; Arrow Part Number: GRM21BR61H475ME51L; Arrow Price/Stock: https://www.arrow.com/en/products/grm21br61h475me51l/murata-manufacturing?region=nac
C27 = CL31X107MQKNNWE: Capacitor; Manufacturer_Name: SAMSUNG; Datasheet Link: https://www.digikey.sg/en/products/detail/samsung-electro-mechanics/CL31X107MQKNNWE/25854287?srsltid=AfmBOoqYZ52GRQ9Xlh8bi0lGOe-KtDJ1wz9-WyaigKcCVSEueXc8l4on; Height: 1.9mm; Manufacturer_Part_Number: CL31X107MQKNNWE; Mouser Part Number: 187-CL31X107MQKNNWE; Mouser Price/Stock: https://www.mouser.co.uk/ProductDetail/Samsung-Electro-Mechanics/CL31X107MQKNNWE?qs=Jm2GQyTW%2FbjTv%252BH%2F%252BndEuA%3D%3D
C35 = 06035A180JAT4A: Capacitor; Manufacturer_Name: Kyocera AVX; Datasheet Link: https://componentsearchengine.com/Datasheets/1/06031A100FAT2A.pdf; Height: 0.9mm; Manufacturer_Part_Number: 06035A180JAT4A; Mouser Part Number: 581-06035A180JAT4A; Mouser Price/Stock: https://www.mouser.co.uk/ProductDetail/AVX/06035A180JAT4A?qs=GMfvKSOiCGHkuDR8fcucAQ%3D%3D
C36 = C0603C223K5RAC-TU: Capacitor; Manufacturer_Name: KEMET; Datasheet Link: https://www.kemet.com/specsheet/C0603C223K5RACTU; Height: 0.87mm; Manufacturer_Part_Number: C0603C223K5RAC-TU
D5 = B560C-13-F: Diode; Manufacturer_Name: Diodes Incorporated; Datasheet Link: https://datasheet.lcsc.com/szlcsc/Diodes-Incorporated-B560C-13-F_C85100.pdf; Height: 2.5mm; Manufacturer_Part_Number: B560C-13-F; Mouser Part Number: 621-B560C-F; Mouser Price/Stock: https://www.mouser.co.uk/ProductDetail/Diodes-Incorporated/B560C-13-F?qs=OC0R%252Bhozcm%252BAsjMXklZLIw%3D%3D; Arrow Part Number: B560C-13-F; Arrow Price/Stock: https://www.arrow.com/en/products/b560c-13-f/diodes-incorporated?utm_currency=USD&region=nac
IC6 = TPS54560BQDDARQ1: Integrated Circuit; Manufacturer_Name: Texas Instruments; Datasheet Link: http://www.ti.com/lit/gpn/tps54560b-q1; Height: 1.7mm; Manufacturer_Part_Number: TPS54560BQDDARQ1; Mouser Part Number: 595-TPS54560BQDDARQ1; Mouser Price/Stock: https://www.mouser.co.uk/ProductDetail/Texas-Instruments/TPS54560BQDDARQ1?qs=Mv7BduZupUi0AsDfghsxzg%3D%3D; Arrow Part Number: TPS54560BQDDARQ1; Arrow Price/Stock: https://www.arrow.com/en/products/tps54560bqddarq1/texas-instruments?utm_currency=USD&region=nac
L1 = SRR1280-180M: Inductor; Manufacturer_Name: Bourns; Datasheet Link: https://www.bourns.com/docs/Product-Datasheets/SRR1280.pdf; Height: 8mm; Manufacturer_Part_Number: SRR1280-180M; Mouser Part Number: 652-SRR1280-180M; Mouser Price/Stock: https://www.mouser.co.uk/ProductDetail/Bourns/SRR1280-180M?qs=brMhP%2FMjUfeRcSm%2FRxSrFQ%3D%3D; Arrow Part Number: SRR1280-180M; Arrow Price/Stock: https://www.arrow.com/en/products/srr1280-180m/bourns?region=nac
LED2 = 150060GS75000: LED; Manufacturer_Name: Wurth Elektronik; Datasheet Link: https://www.we-online.com/catalog/datasheet/150060GS75000.pdf; Height: 0.7mm; Manufacturer_Part_Number: 150060GS75000; Mouser Part Number: 710-150060GS75000; Mouser Price/Stock: https://www.mouser.co.uk/ProductDetail/Wurth-Elektronik/150060GS75000?qs=LlUlMxKIyB0UYkq5lDO8nA%3D%3D
R15 = ERJ-3EKF3652V: Resistor; Manufacturer_Name: Panasonic; Datasheet Link: http://industrial.panasonic.com/cdbs/www-data/pdf/RDA0000/AOA0000C86.pdf; Height: 0.55mm; Manufacturer_Part_Number: ERJ-3EKF3652V; Mouser Part Number: 667-ERJ-3EKF3652V; Mouser Price/Stock: https://www.mouser.co.uk/ProductDetail/Panasonic/ERJ-3EKF3652V?qs=MVjVSMjNRMrgC1BnfDObyw%3D%3D; Arrow Part Number: ERJ-3EKF3652V; Arrow Price/Stock: https://www.arrow.com/en/products/erj-3ekf3652v/panasonic?region=nac
R16 = CRCW060312K4FKEA: Resistor; Manufacturer_Name: Vishay; Datasheet Link: http://www.vishay.com/docs/20035/dcrcwe3.pdf; Height: 0.5mm; Manufacturer_Part_Number: CRCW060312K4FKEA; Mouser Part Number: 71-CRCW0603-12.4K-E3; Mouser Price/Stock: https://www.mouser.co.uk/ProductDetail/Vishay-Dale/CRCW060312K4FKEA?qs=8tsW7z%2Fc78of4VB3wUPkkg%3D%3D; Arrow Part Number: CRCW060312K4FKEA; Arrow Price/Stock: https://www.arrow.com/en/products/crcw060312k4fkea/vishay?utm_currency=USD&region=nac
R17 = ERJ-3EKF3833V: Resistor; Manufacturer_Name: Panasonic; Datasheet Link: http://industrial.panasonic.com/cdbs/www-data/pdf/RDA0000/AOA0000C86.pdf; Height: 0.55mm; Manufacturer_Part_Number: ERJ-3EKF3833V; Mouser Part Number: 667-ERJ-3EKF3833V; Mouser Price/Stock: https://www.mouser.com/Search/Refine.aspx?Keyword=667-ERJ-3EKF3833V; Arrow Part Number: ERJ-3EKF3833V; Arrow Price/Stock: https://www.arrow.com/en/products/erj-3ekf3833v/panasonic
R18 = TNPW060311K7BEEA: Resistor; Manufacturer_Name: Vishay; Datasheet Link: https://componentsearchengine.com/Datasheets/1/TNPW060311K7BEEA.pdf; Height: 0.55mm; Manufacturer_Part_Number: TNPW060311K7BEEA; Mouser Part Number: 71-TNPW060311K7BEEA; Mouser Price/Stock: https://www.mouser.co.uk/ProductDetail/Vishay-Dale/TNPW060311K7BEEA?qs=ixLl9tGHk8sqv6nzL7A%252BsQ%3D%3D
R38 = RMCF0603JT1K00: as R4 on sheet STM32; Datasheet Link: https://www.seielect.com/Catalog/SEI-RMCF_RMCP.pdf; Height: 0.55mm; Manufacturer_Part_Number: RMCF0603JT1K00; Mouser Part Number: 708-RMCF0603JT1K00; Mouser Price/Stock: https://www.mouser.co.uk/ProductDetail/SEI-Stackpole/RMCF0603JT1K00?qs=FESYatJ8odK3lrUeqnFxyg%3D%3D; Arrow Part Number: RMCF0603JT1K00; Arrow Price/Stock: https://www.arrow.com/en/products/rmcf0603jt1k00/stackpole-electronics?region=nac

## Sheet CAN.SchDoc
size A
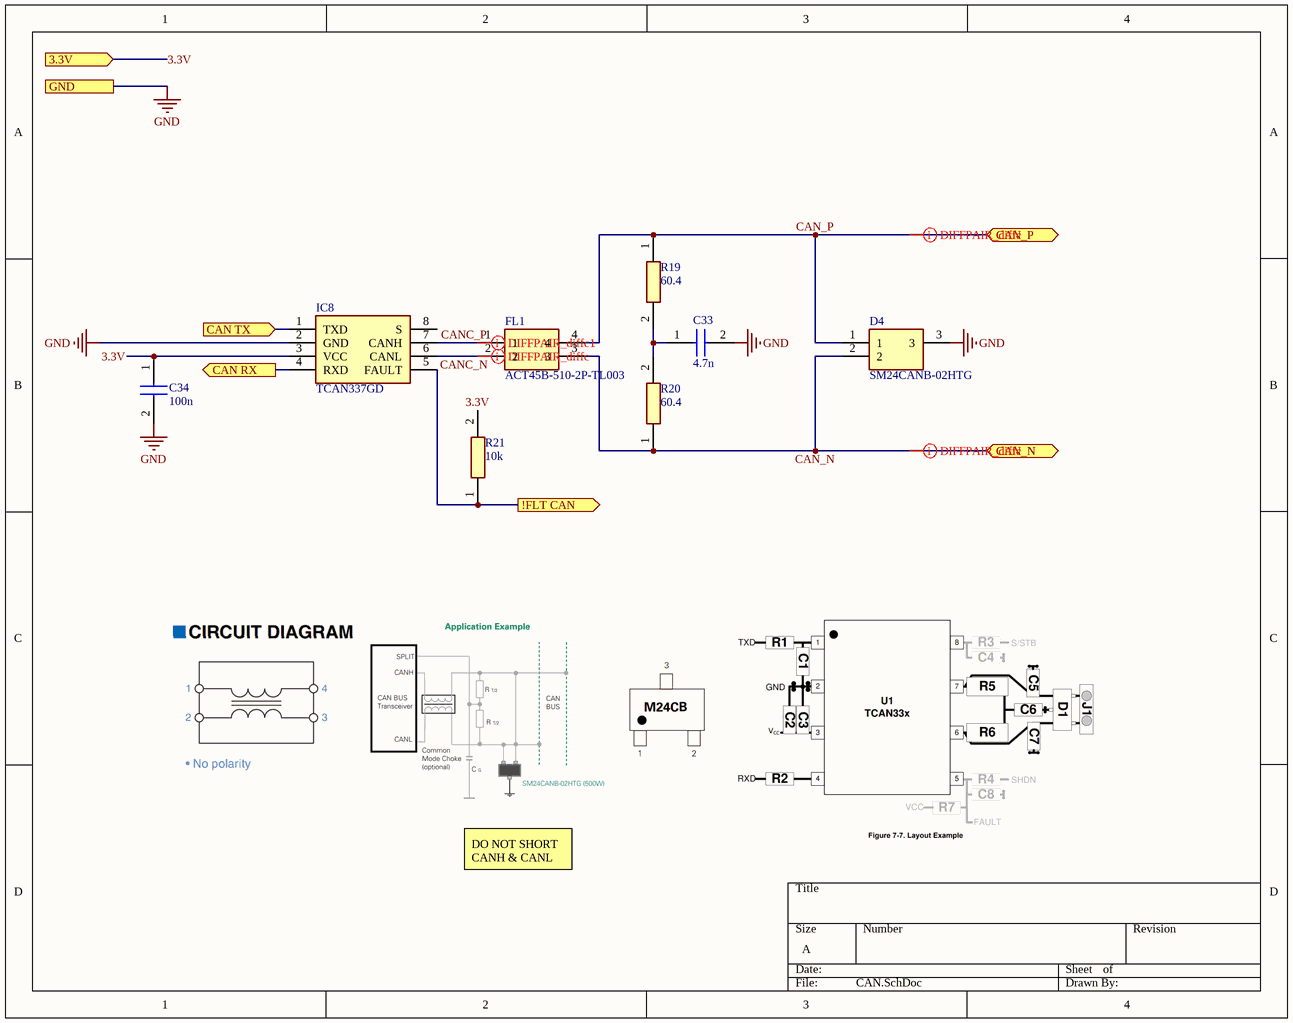
[diagram p9: CAN.SchDoc]

### Parts
C33  4.7n  [CAPC1608X95N]
C34  100n  [CAPC1608X90N]
D4  SM24CANB-02HTG  [SM24CANB02HTG]
FL1  ACT45B-510-2P-TL003  [ACT45B1012PTL003]
IC8  TCAN337GD  [SOIC127P600X175-8N]
R19  60.4  [RESC1608X50N]
R20  60.4  [RESC1608X50N]
R21  10k  [RESC1608X55N]

### Ports
3.3V (in), !FLT CAN (out), CAN RX (out), CAN TX (in), CAN_N (bidir), CAN_P (bidir), GND

### Nets
GND: C33.2 C34.2 D4.3 IC8.2(GND) ; port GND
3.3V: C34.1 IC8.3(VCC) R21.2 ; port 3.3V
!FLT CAN: IC8.5(FAULT) R21.1 ; port !FLT CAN
CAN RX: IC8.4(RXD) ; port CAN RX
CAN TX: IC8.1(TXD) ; port CAN TX
CAN_N: D4.2 FL1.3 R20.1 ; port CAN_N
CAN_P: D4.1 FL1.4 R19.1 ; port CAN_P
CANC_N: FL1.2 IC8.6(CANL)
CANC_P: FL1.1 IC8.7(CANH)
NetC33_1: C33.1 R19.2 R20.2

Not connected (* = marked no-connect by the designer): IC8 8(S)

### Layout directives
differential pair; differential pair class diffc; differential pair: CAN_N, CAN_P, CANC_N
differential pair; differential pair class diffc1; differential pair: CANC_P

### Notes on the sheet
- DO NOT SHORT CANH & CANL

### Library data of the parts
C33 = 0603B472M500CT: Capacitor; Manufacturer_Name: Walsin Technology Corporation; Datasheet Link: https://www.passivecomponent.com/wp-content/uploads/datasheet/WTC_MLCC_General_Purpose.pdf; Height: 0.95mm; Manufacturer_Part_Number: 0603B472M500CT
C34 = 06035C104J4Z2A: as C2 on sheet STM32; Datasheet Link: https://componentsearchengine.com/Datasheets/1/06031A100FAT2A.pdf; Height: 0.9mm; Manufacturer_Part_Number: 06035C104J4Z2A; Mouser Part Number: 581-06035C104J4Z2A; Mouser Price/Stock: https://www.mouser.co.uk/ProductDetail/KYOCERA-AVX/06035C104J4Z2A?qs=Awwwc1gvTnlncvTGCFZvkw%3D%3D; Arrow Part Number: 06035C104J4Z2A; Arrow Price/Stock: https://www.arrow.com/en/products/06035c104j4z2a/avx
D4 = SM24CANB-02HTG: TVS Diode (Bi-directional); Manufacturer_Name: LITTELFUSE; Datasheet Link: https://www.littelfuse.com/products/overvoltage-protection/tvs-diode-arrays/general-purpose/sm24canb/sm24canb-02htg; Height: 1.12mm; Manufacturer_Part_Number: SM24CANB-02HTG; Mouser Part Number: 576-SM24CANB-02HTG; Mouser Price/Stock: https://www.mouser.co.uk/ProductDetail/Littelfuse/SM24CANB-02HTG?qs=bWsWnctWn1wbKmCYlcUmHw%3D%3D; Arrow Part Number: SM24CANB-02HTG; Arrow Price/Stock: https://www.arrow.com/en/products/sm24canb-02htg/littelfuse?utm_currency=USD&region=nac
FL1 = ACT45B-510-2P-TL003: Filter; Manufacturer_Name: TDK; Datasheet Link: https://product.tdk.com/system/files/dam/doc/product/emc/emc/cmf_cmc/catalog/cmf_automotive_signal_act45b_en.pdf; Height: 3mm; Manufacturer_Part_Number: ACT45B-510-2P-TL003; Mouser Part Number: 810-ACT45B5102PTL003; Mouser Price/Stock: https://www.mouser.co.uk/ProductDetail/TDK/ACT45B-510-2P-TL003?qs=U1cgCdF9Le9LCroNYLqljw%3D%3D; Arrow Part Number: ACT45B-510-2P-TL003; Arrow Price/Stock: https://www.arrow.com/en/products/act45b-510-2p-tl003/tdk?utm_currency=USD&region=nac
IC8 = TCAN337GD: Integrated Circuit; Manufacturer_Name: Texas Instruments; Datasheet Link: https://www.arrow.com/en/products/tcan337gd/texas-instruments; Height: 1.75mm; Manufacturer_Part_Number: TCAN337GD; Mouser Part Number: 595-TCAN337GD; Mouser Price/Stock: https://www.mouser.co.uk/ProductDetail/Texas-Instruments/TCAN337GD?qs=gMfM3zrbS4qmjQESf%252BTgJw%3D%3D; Arrow Part Number: TCAN337GD; Arrow Price/Stock: https://www.arrow.com/en/products/tcan337gd/texas-instruments?region=europe
R19 R20 = CRCW060360R4FKEA: Resistor; Manufacturer_Name: Vishay; Datasheet Link: http://www.vishay.com/docs/20035/dcrcwe3.pdf; Height: 0.5mm; Manufacturer_Part_Number: CRCW060360R4FKEA; Mouser Part Number: 71-CRCW0603-60.4-E3; Mouser Price/Stock: https://www.mouser.co.uk/ProductDetail/Vishay-Dale/CRCW060360R4FKEA?qs=6fyMJ9%2FiJ9KMVX8MBWVfDg%3D%3D; Arrow Part Number: CRCW060360R4FKEA; Arrow Price/Stock: https://www.arrow.com/en/products/crcw060360r4fkea/vishay
R21 = CRGCQ0603F10K: as R1 on sheet STM32; Datasheet Link: https://www.te.com/commerce/DocumentDelivery/DDEController?Action=showdoc&DocId=Data+Sheet%7F1773204-3%7F1%7Fpdf%7FEnglish%7FENG_DS_1773204-3_1.pdf%7F5-2176339-2; Height: 0.55mm; Manufacturer_Part_Number: CRGCQ0603F10K; Mouser Part Number: 279-CRGCQ0603F10K; Mouser Price/Stock: https://www.mouser.co.uk/ProductDetail/TE-Connectivity-Holsworthy/CRGCQ0603F10K?qs=wUXugUrL1qxhM765MzQWJg%3D%3D; Arrow Part Number: CRGCQ0603F10K; Arrow Price/Stock: https://www.arrow.com/en/products/crgcq0603f10k/te-connectivity?region=nac

## Nets that join several sheets
GND: Relay_Control (6 pins), Connectors (12 pins), LEDs/+ (IC4_+.2), LEDs/- (IC4_-.2), LEDs/PC (IC4_PC.2), LEDs/HB (IC4_HB.2), LEDs/RTD_Sig_In (IC4_RTD.2), Precharge_Fail (IC9.2), STM32 (27 pins), eFuse (11 pins), 24V_Buck_3_3V (11 pins), CAN (C33.2 C34.2 D4.3 IC8.2)
3.3V: Connectors (J1.3 J3.2), LEDs/+ (LED_+.2), LEDs/- (LED_-.2), LEDs/PC (LED_PC.2), LEDs/HB (LED_HB.2), LEDs/RTD_Sig_In (LED_RTD.2), Precharge_Fail (PC_FAIL.2), STM32 (25 pins), 24V_Buck_3_3V (C27.1 L1.2 LED2.2 R15.1), CAN (C34.1 IC8.3 R21.2)
24V: Connectors (J11.1), eFuse (IC2.15 IC2.16 LED1.2 R6.1), 24V_Buck_3_3V (C25.1 C26.1 IC6.2)
24V Unfused: Connectors (J2.1), eFuse (5 pins)
!FLT CAN: STM32 (IC1.43), CAN (IC8.5 R21.1)
+ Relay GND: Relay_Control (D1.2 M1.3), Connectors (J5.1)
+ Signal: Relay_Control (M1.1 R42.1), LEDs/+ (IC4_+.1), STM32 (IC1.35)
- Relay GND: Relay_Control (D2.2 M2.3), Connectors (J6.1)
- Signal: Relay_Control (M2.1 R43.1), LEDs/- (IC4_-.1), STM32 (IC1.33)
CAN RX: STM32 (IC1.44), CAN (IC8.4)
CAN TX: STM32 (IC1.45), CAN (IC8.1)
CAN_N: Connectors (J8.1), CAN (D4.2 FL1.3 R20.1)
CAN_P: Connectors (J8.2), CAN (D4.1 FL1.4 R19.1)
Heartbeat: LEDs/HB (IC4_HB.1), STM32 (IC1.16)
IMON: STM32 (IC1.53), eFuse (IC2.10 R10.1)
NetIC1_21: Connectors (J9.4), STM32 (IC1.21)
NetIC1_23: Connectors (J9.2), STM32 (IC1.23)
NetIC1_25: Connectors (J9.3), STM32 (IC1.25)
NetIC1_27: Connectors (J9.1), STM32 (IC1.27)
NRST: Connectors (J1.12), STM32 (C19.1 IC1.7 S1.1 S1.3)
PC Signal: Relay_Control (M3.1 R44.1), LEDs/PC (IC4_PC.1), STM32 (IC1.37)
PC_Enable: Connectors (J4.1), STM32 (R1.1 R4.1)
PC_Fail: Precharge_Fail (IC9.1), STM32 (IC1.51)
Precharge Relay GND: Relay_Control (D3.2 M3.3), Connectors (J7.1)
RTD_Sig: Relay_Control (D1.1 D2.1 D3.1), Connectors (J5.2 J6.2 J7.2 J10.2), LEDs/RTD_Sig_In (IC4_RTD.1)
SCL: Connectors (J13.2), STM32 (R3.1)
SDA: Connectors (J13.1), STM32 (R2.1)
SWCLK: Connectors (J1.6), STM32 (IC1.49)
SWDIO: Connectors (J1.4), STM32 (IC1.46)
SWO: Connectors (J1.8), STM32 (IC1.55)